# EAGLE design display2 (EAGLE 4.16)
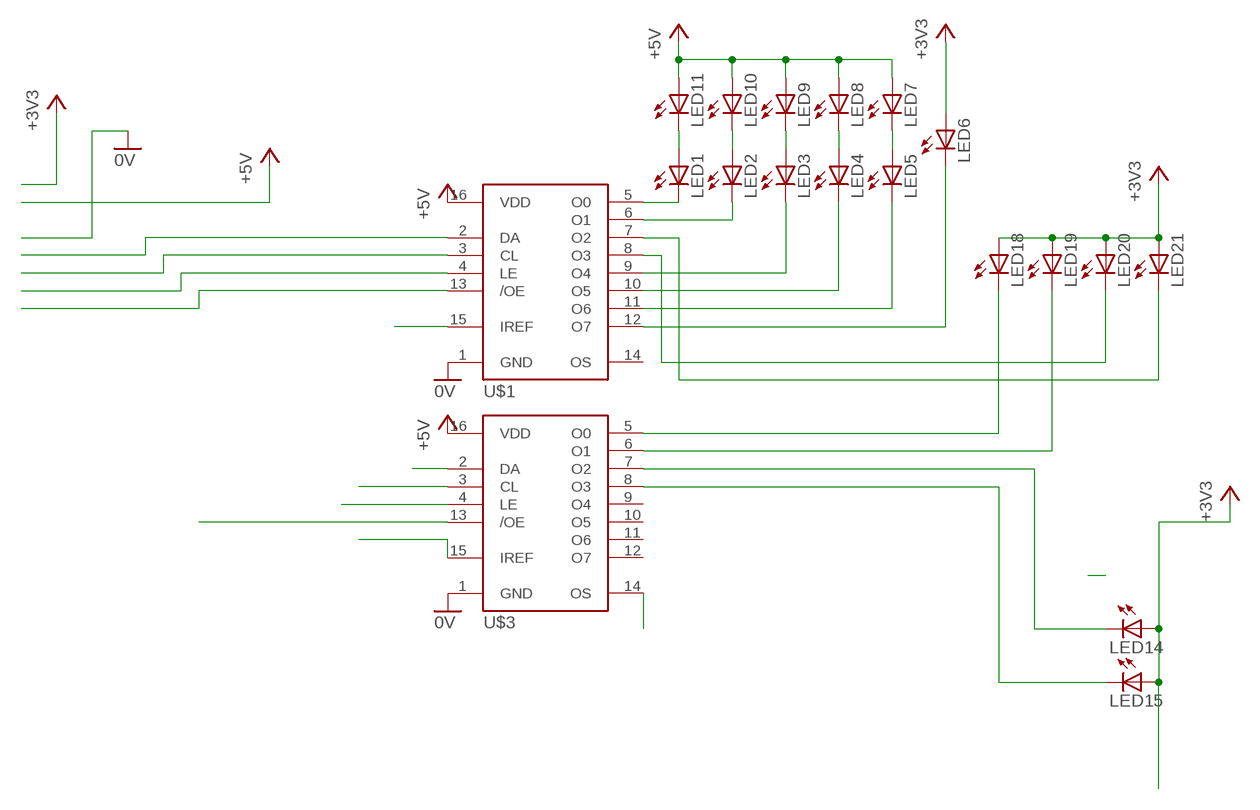
[diagram p0: schematic, sheet 1]

## Parts
LED1  LED5MM  [LED5MM]
LED2  LED5MM  [LED5MM]
LED3  LED5MM  [LED5MM]
LED4  LED5MM  [LED5MM]
LED5  LED5MM  [LED5MM]
LED6  LED5MM  [LED5MM]
LED7  LED5MM  [LED5MM]
LED8  LED5MM  [LED5MM]
LED9  LED5MM  [LED5MM]
LED10  LED5MM  [LED5MM]
LED11  LED5MM  [LED5MM]
LED14  LED5MM  [LED5MM]
LED15  LED5MM  [LED5MM]
LED18  LED5MM  [LED5MM]
LED19  LED5MM  [LED5MM]
LED20  LED5MM  [LED5MM]
LED21  LED5MM  [LED5MM]
U$1  A6275  [SOIC16]
U$3  A6275  [SOIC16]

## Nets
0V: U$1.1(GND) U$3.1(GND)
+3V3: LED6.A LED14.A LED15.A LED18.A LED19.A LED20.A LED21.A
+5V: LED7.A LED8.A LED9.A LED10.A LED11.A U$1.16(VDD) U$3.16(VDD)
N$1: LED1.K(C) U$1.5(O0)
N$2: LED2.K(C) U$1.6(O1)
N$3: LED3.K(C) U$1.9(O4)
N$4: LED4.K(C) U$1.10(O5)
N$5: LED5.K(C) U$1.11(O6)
N$6: LED6.K(C) U$1.12(O7)
N$7: LED18.K(C) U$3.5(O0)
N$8: LED19.K(C) U$3.6(O1)
N$9: LED20.K(C) U$1.8(O3)
N$10: LED14.K(C) U$3.7(O2)
N$11: U$1.2(DA)
N$12: U$1.3(CL)
N$13: U$1.4(LE)
N$14: U$3.2(DA)
N$15: U$3.14(OS)
N$16: LED1.A LED11.K(C)
N$17: LED2.A LED10.K(C)
N$18: LED3.A LED9.K(C)
N$19: LED4.A LED8.K(C)
N$20: LED5.A LED7.K(C)
N$21: U$3.3(CL)
N$22: U$3.4(LE)
N$23: U$3.13(/OE)
N$24: U$1.13(/OE)
N$25: LED15.K(C) U$3.8(O3)
N$26: U$1.15(IREF)
N$27: U$3.15(IREF)
N$32: LED21.K(C) U$1.7(O2)
Unconnected: U$1.14(OS) U$3.9(O4) U$3.10(O5) U$3.11(O6) U$3.12(O7)

## Library data of the parts
LED1-LED11 LED14 LED15 LED18-LED21 = led:LED: LED OSRAM: - CHIPLED LG R971, LG N971, LY N971, LG Q971, LY Q971, LO R971, LY R971 LH N974, LH R974 LS Q976, LO Q976, LY Q976 LO Q996 - Hyper CHIPLED LW Q18S LB Q993, LB Q99A, LB R99A - SideLED LS A670, LO A670, LY A670, LG A670, LP A670 LB A673, LV A673, LT A673, LW A673 LH A674 LY A675 LS A676, LA A676, LO A676, LY A676, LW A676 LS A679, LY A679, LG A679 - Hyper Micro SIDELED® LS Y876, LA Y876, LO Y876, LY Y876 LT Y87S - SmartLED LW L88C, LW L88S LB L89C, LB L89S, LG L890 LS L89K, LO L89K, LY L89K LS L896, LA L896, LO L896, LY L896 - TOPLED LS T670, LO T670, LY T670, LG T670, LP T670 LSG T670, LSP T670, LSY T670, LOP T670, LYG T670 LG T671, LOG T671, LSG T671 LB T673, LV T673, LT T673, LW T673 LH T674 LS T676, LA T676, LO T676, LY T676, LB T676, LH T676, LSB T676, LW T676 LB T67C, LV T67C, LT T67C, LS T67K, LO T67K, LY T67K, LW E67C LS E67B, LA E67B, LO E67B, LY E67B, LB E67C, LV E67C, LT E67C LW T67C LS T679, LY T679, LG T679 LS T770, LO T770, LY T770, LG T770, LP T770 LB T773, LV T773, LT T773, LW T773 LH T774 LS E675, LA E675, LY E675, LS T675 LS T776, LA T776, LO T776, LY T776, LB T776 LHGB T686 LT T68C, LB T68C - Hyper Mini TOPLED® LB M676 - Mini TOPLED Santana® LG M470 LS M47K, LO M47K, LY M47K Source: http://www.osram.convergy.de/
U$1 U$3 = rnie04:A6275

## Board
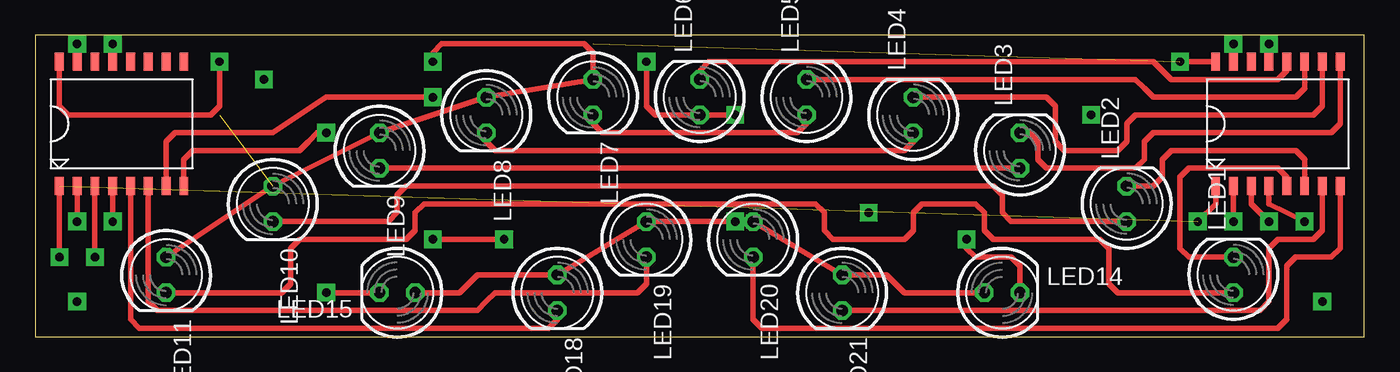
[diagram p1: board, top side]
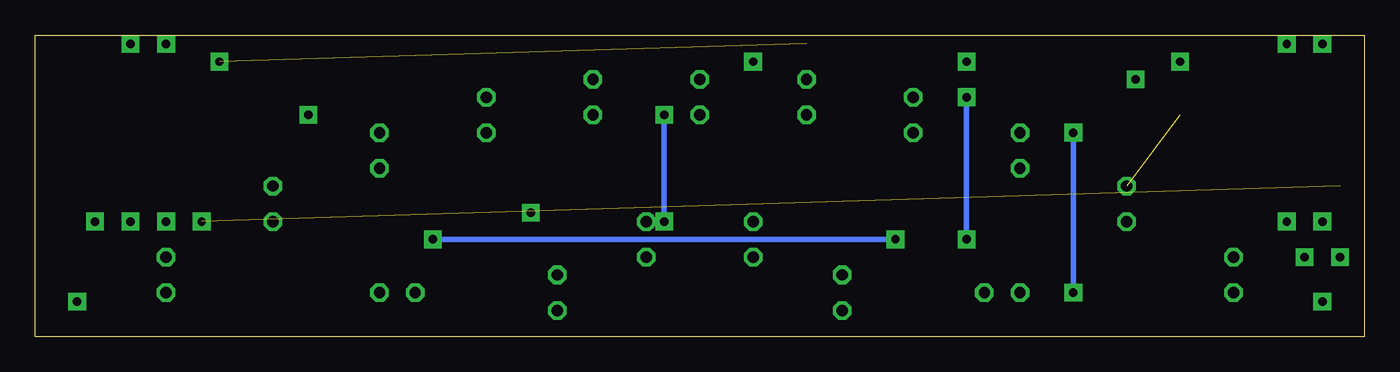
[diagram p2: board, bottom side, seen from below]

Size 94.92 x 21.58 mm. Coordinates in mm from the lower left corner, seen from the top.
Outline: 0,0 94.92,0 94.92,21.58 0,21.58 0,0
Copper layers (1*16): Top 0.035mm / dielectric 1.5mm / Bottom 0.035mm
Design rules "default": minimum track width 10mil, minimum drill 24mil, track to track 8mil, track to pad 8mil, pad to pad 8mil, via to via 8mil, smd to smd 8mil, copper to edge 40mil, drill to drill 8mil, minimum pad ring 10mil, minimum via ring 8mil, stop-mask expansion 4mil, vias tented up to drill 0mil, thermal gap 10mil

### Footprints (pad centres in the part's own frame; a part is rotated, then mirrored left to right if it is on the bottom)
LED5MM = drill 0.813 octagon: A -1.27,0; K 1.27,0
SOIC16 = smd 1.27 x 0.635: 1 -2.54,2.54; 2 -2.54,1.27; 3 -2.54,0; 4 -2.54,-1.27; 5 -2.54,-2.54; 6 -2.54,-3.81; 7 -2.54,-5.08; 8 -2.54,-6.35; 9 6.35,-6.35; 10 6.35,-5.08; 11 6.35,-3.81; 12 6.35,-2.54; 13 6.35,-1.27; 14 6.35,0; 15 6.35,1.27; 16 6.35,2.54

### Placement (x,y rotation side)
LED1  85.56,4.44 90 top
LED2  77.94,9.52 90 top
LED3  70.32,13.33 90 top
LED4  62.7,15.87 90 top
LED5  55.08,17.14 90 top
LED6  47.46,17.14 90 top
LED7  39.84,17.14 270 top
LED8  32.22,15.87 270 top
LED9  24.6,13.33 270 top
LED10  16.98,9.52 270 top
LED11  9.36,4.44 270 top
LED14  69.05,3.17 0 top
LED15  25.87,3.17 180 top
LED18  37.3,3.17 270 top
LED19  43.65,6.98 270 top
LED20  51.27,6.98 270 top
LED21  57.62,3.17 270 top
U$1  86.83,13.33 90 top
U$3  4.28,13.33 90 top

### Tracks (layer width: path | path; a pad name or v marks a point on that pad's centre or on a via)
0V  (via drill 0.6 pad 1.27)  (1 unrouted)
  Top 0.406: v1.74,5.71 U$3.1 | U$1.1 84.29,9.52 v83.02,8.25
+3V3  (via drill 0.6, 0.6 pad 1.27)
  Top 0.406: v50,8.25 LED20.A | v50,8.25 LED19.A LED18.A 31.59,4.44 30.95,3.8 30.31,3.17 LED15.A | v50,8.25 LED20.A | LED20.A LED21.A 60.8,4.44 61.43,3.8 62.07,3.17 LED14.A | v50,15.87 LED6.A 44.28,15.87 43.65,16.51 v43.65,19.68
  Bottom 0.406: v50,8.25 v50,15.87
  other vias: 51.27,8.25
+5V  (via drill 0.6 pad 1.27)  (2 unrouted)
  Top 0.406: LED11.A LED10.A LED9.A LED8.A LED7.A 39.84,20.32 39.2,20.95 29.04,20.95 28.41,20.32 v28.41,19.68 | U$1.16 83.02,19.68 v81.75,19.68 | U$3.16 1.74,16.51 2.38,15.87 12.54,15.87 13.17,16.51 v13.17,19.68
N$1
  Top 0.406: LED1.K 82.39,5.71 81.75,6.35 81.75,11.43 82.39,12.06 88.74,12.06 89.37,11.43 U$1.5
N$2
  Top 0.406: LED2.K 79.85,10.79 80.48,11.43 80.48,12.7 81.12,13.33 90.01,13.33 90.64,12.7 U$1.6
N$3
  Top 0.406: LED3.K 70.96,14.6 71.59,13.96 71.59,12.7 72.23,12.06 78.58,12.06 79.21,12.7 79.21,13.96 79.85,14.6 92.55,14.6 93.18,15.24 U$1.9
N$4
  Top 0.406: LED4.K 72.23,17.14 72.86,16.51 72.86,13.96 73.5,13.33 77.31,13.33 77.94,13.96 77.94,15.24 78.58,15.87 91.28,15.87 91.91,16.51 U$1.10
N$5
  Top 0.406: LED5.K 78.58,18.41 79.21,17.77 79.85,17.14 90.01,17.14 90.64,17.77 U$1.11
N$6
  Top 0.406: LED6.K 47.46,19.05 48.09,19.68 79.85,19.68 80.48,19.05 81.12,18.41 88.74,18.41 89.37,19.05 U$1.12
N$7
  Top 0.406: LED18.K 37.3,1.27 36.66,0.63 7.46,0.63 6.82,1.27 U$3.5
N$8
  Top 0.406: LED19.K 43.65,3.8 43.02,3.17 32.85,3.17 32.22,2.54 31.59,1.9 8.72,1.9 8.09,2.54 U$3.6
N$9
  Top 0.406: U$1.8 93.18,6.35 92.55,5.71 90.01,5.71 89.37,5.08 89.37,1.27 88.74,0.63 51.91,0.63 51.27,1.27 LED20.K
N$10  (via drill 0.6 pad 1.27)
  Top 0.406: LED14.K 70.32,5.08 69.69,5.71 67.15,5.71 66.51,6.35 v66.51,6.98 | v28.41,6.98 v33.49,6.98 | v28.41,17.14 20.79,17.14 16.98,14.6 9.99,14.6 9.36,13.96 U$3.7
  Bottom 0.406: v33.49,6.98 v66.51,6.98 | v28.41,17.14 v28.41,6.98
N$11  (via drill 0.6 pad 1.27)
  Top 0.406: v85.56,8.25 U$1.2
N$12  (via drill 0.6 pad 1.27)
  Top 0.406: U$1.3 86.83,9.52 v88.1,8.25
N$13  (via drill 0.6 pad 1.27)
  Top 0.406: v90.64,8.25 88.1,9.52 U$1.4
N$14  (via drill 0.6 pad 1.27)
  Top 0.406: v3.01,8.25 U$3.2
N$16
  Top 0.406: LED11.K 17.61,3.17 18.25,3.8 18.25,6.35 18.88,6.98 26.5,6.98 27.14,7.62 27.14,8.89 27.77,9.52 55.71,9.52 56.35,8.89 56.35,7.62 56.98,6.98 62.07,6.98 62.7,7.62 62.7,8.89 63.34,9.52 67.15,9.52 67.78,8.89 67.78,7.62 68.42,6.98 76.04,6.98 76.67,6.35 76.67,3.8 77.31,3.17 LED1.A
N$17
  Top 0.406: LED10.K 25.23,8.25 25.87,8.89 25.87,10.16 26.5,10.79 68.42,10.79 69.05,10.16 69.05,8.89 69.69,8.25 LED2.A
N$18
  Top 0.406: LED9.K LED3.A
N$19
  Top 0.406: LED8.K 32.22,13.96 32.85,13.33 62.07,13.33 62.7,13.96 LED4.A
N$20
  Top 0.406: LED7.K 39.84,15.24 40.48,14.6 54.45,14.6 55.08,15.24 LED5.A
N$21  (via drill 0.6 pad 1.27)
  Top 0.406: v4.28,5.71 U$3.3
N$22  (via drill 0.6 pad 1.27)
  Top 0.406: v5.55,8.25 U$3.4
N$23  (via drill 0.6 pad 1.27)
  Top 0.406: U$3.13 v5.55,20.95
N$24  (via drill 0.6 pad 1.27)
  Top 0.406: U$1.13 v88.1,20.95
N$25  (via drill 0.6 pad 1.27)
  Top 0.406: v20.79,3.17 LED15.K | U$3.8 10.63,12.7 11.27,13.33 18.88,13.33 19.52,13.96 20.16,14.6 v20.79,14.6
  Bottom 0.406: v20.79,14.6 v20.79,3.17
N$26  (via drill 0.6 pad 1.27)
  Top 0.406: U$1.15 v85.56,20.95
N$27  (via drill 0.6 pad 1.27)
  Top 0.406: U$3.15 v3.01,20.95
N$28  (via drill 0.6 pad 1.27)
  other vias: 3.01,2.54
N$29  (via drill 0.6 pad 1.27)
  other vias: 91.91,2.54
N$30  (via drill 0.6 pad 1.27)
  other vias: 59.52,8.89
N$31  (via drill 0.6 pad 1.27)
  other vias: 16.34,18.41
N$32
  Top 0.406: LED21.K 87.47,1.9 88.1,2.54 88.1,6.35 88.74,6.98 91.28,6.98 91.91,7.62 U$1.7
N$33  (via drill 0.6 pad 1.27)
  other vias: 75.4,15.87